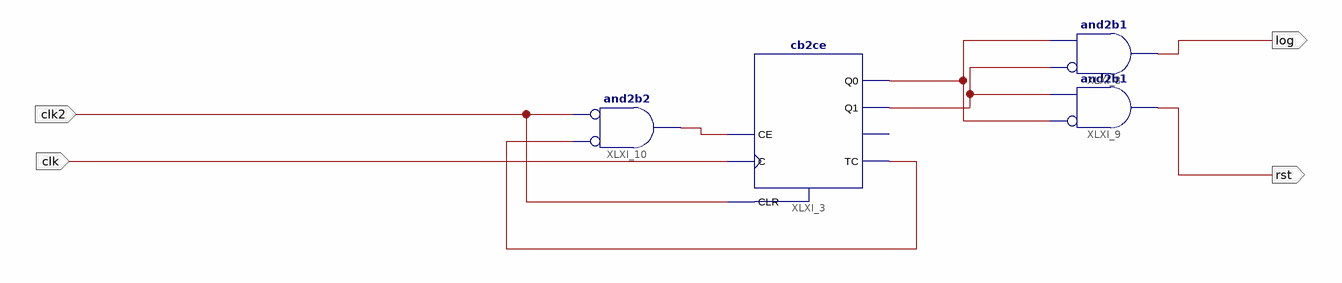
[diagram p0: schematic sheet 1]
// Xilinx ISE schematic counterlogic.sch (spartan3e) as structural Verilog: 4 symbols, 4 ports
module counterlogic (
  input  clk,
  input  clk2,
  output rst,
  output log
);

  wire XLXN_4, XLXN_18, XLXN_19, XLXN_23;

  cb2ce XLXI_3 (.C(clk), .CE(XLXN_4), .CLR(clk2), .Q0(XLXN_19), .Q1(XLXN_18), .TC(XLXN_23));  // open: CEO
  and XLXI_9 (rst, ~XLXN_19, XLXN_18);  // and2b1
  and XLXI_8 (log, ~XLXN_18, XLXN_19);  // and2b1
  and XLXI_10 (XLXN_4, ~XLXN_23, ~clk2);  // and2b2
endmodule
